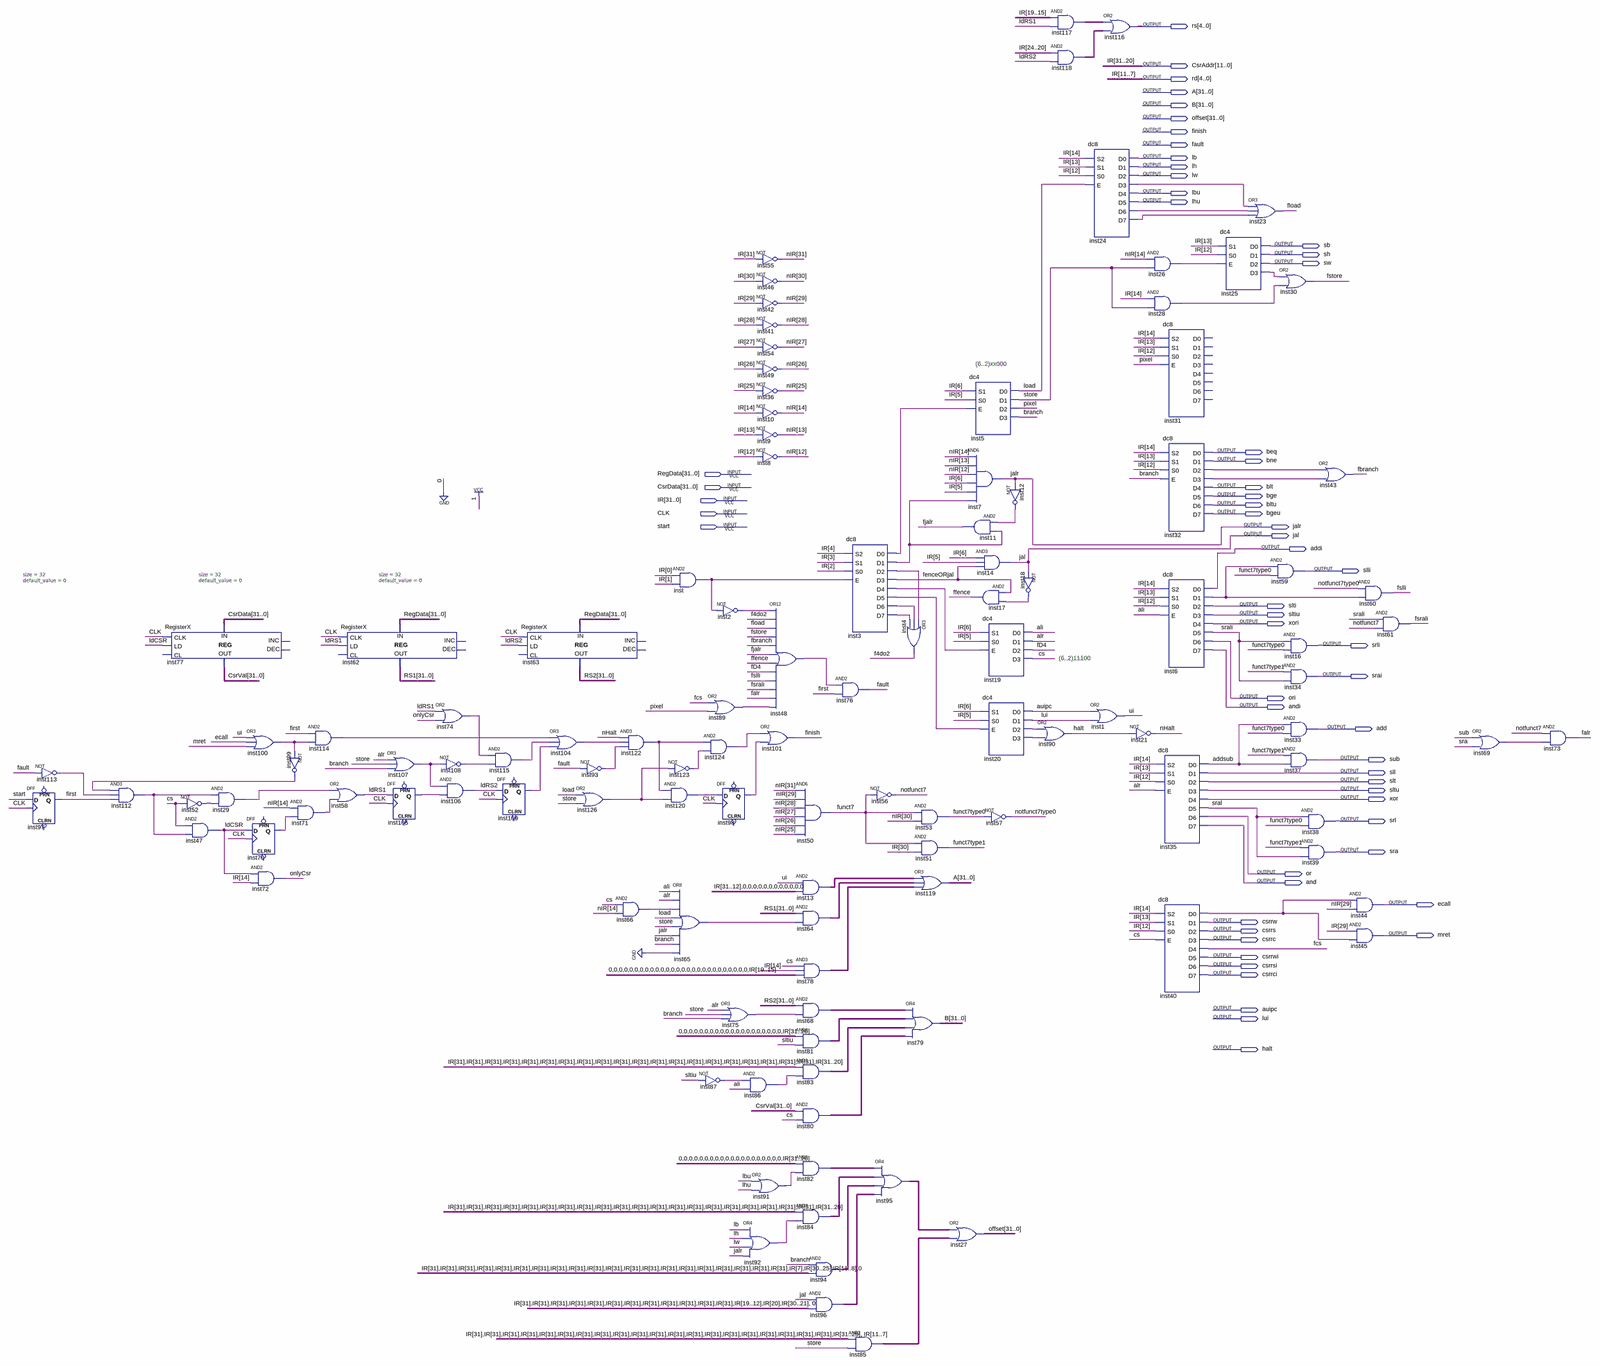
[diagram p0: schematic sheet, whole]
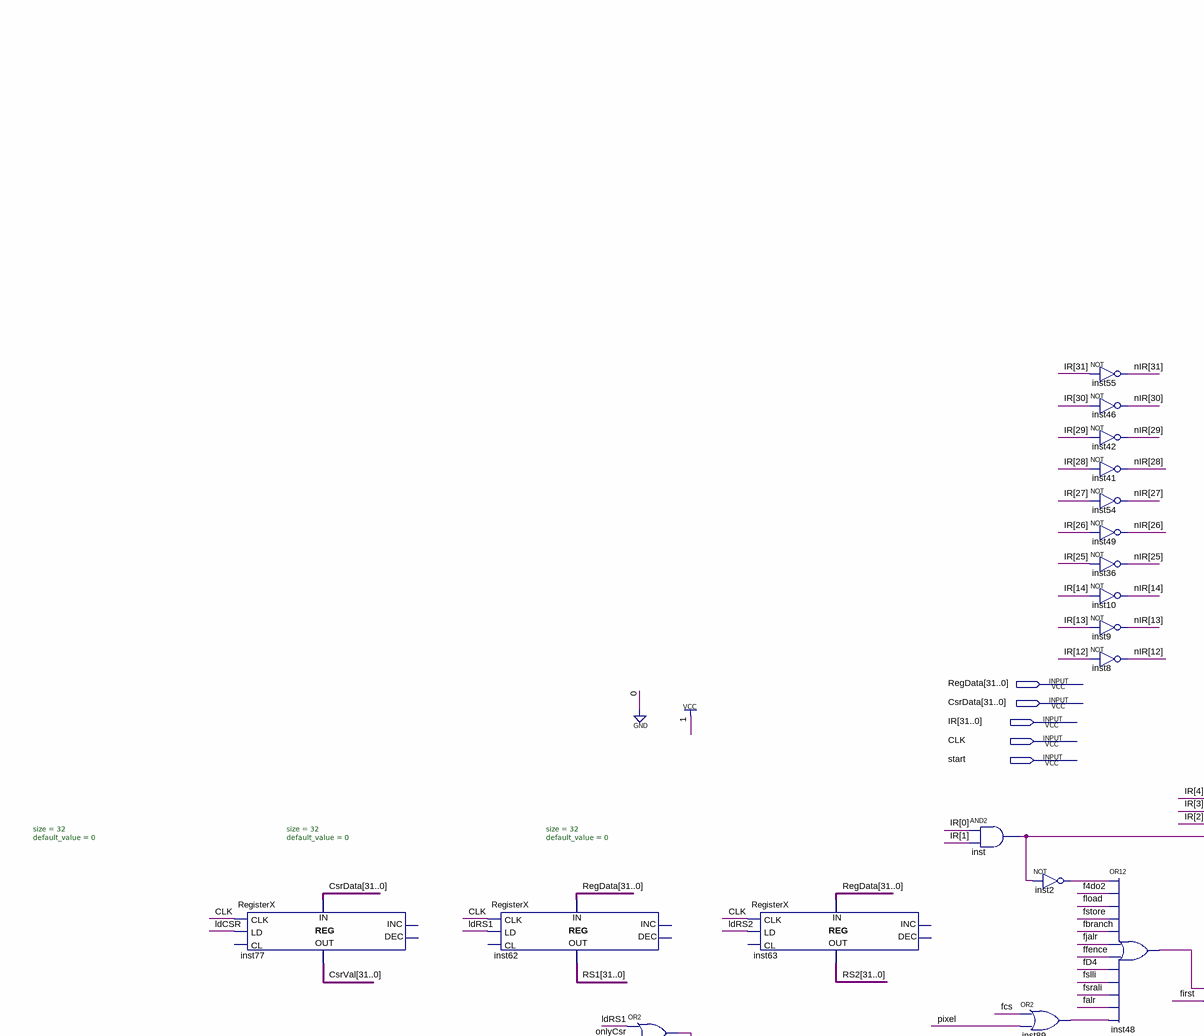
[diagram p1: schematic sheet, upper left part]
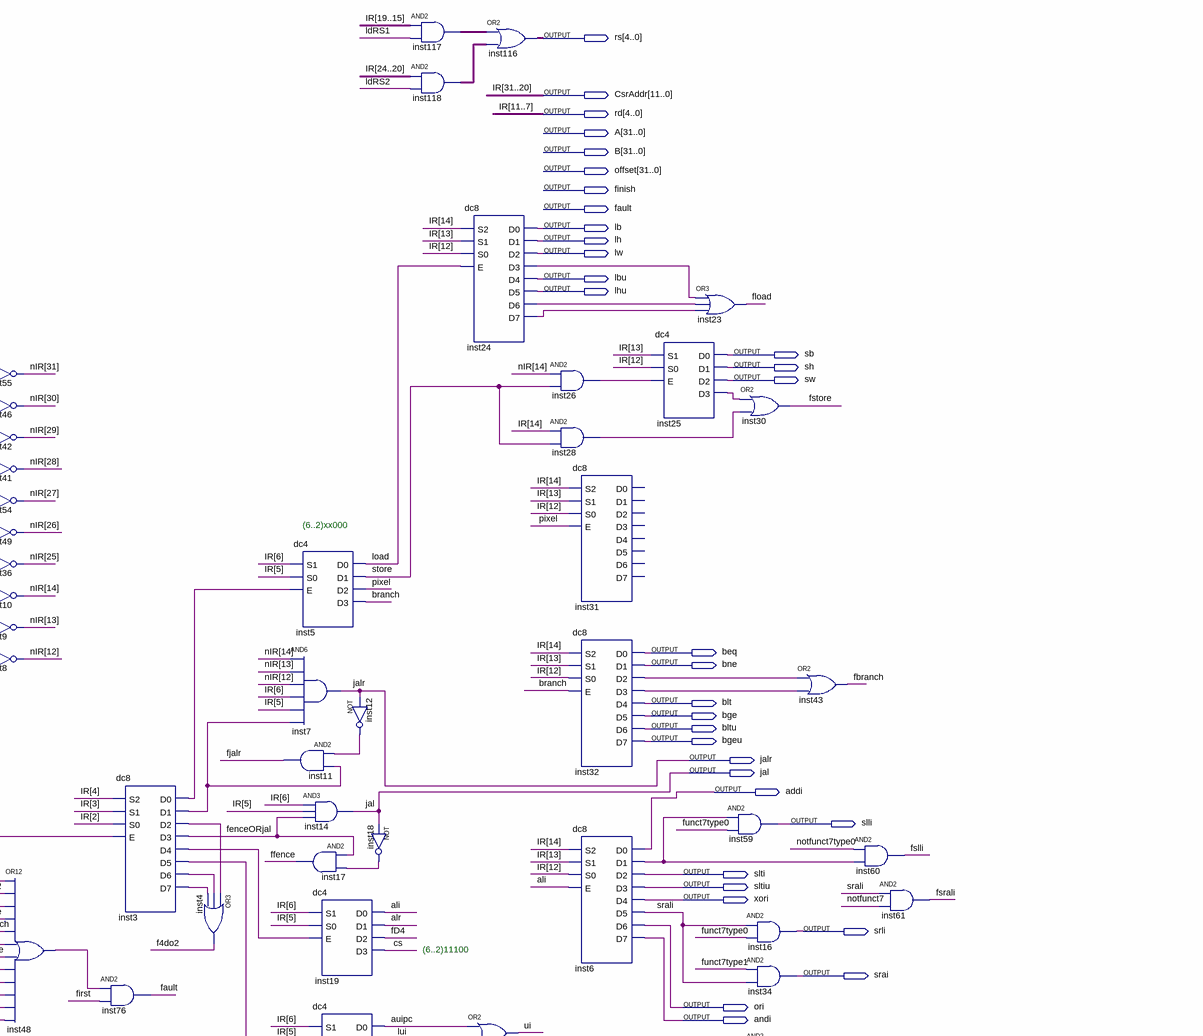
[diagram p2: schematic sheet, upper right part]
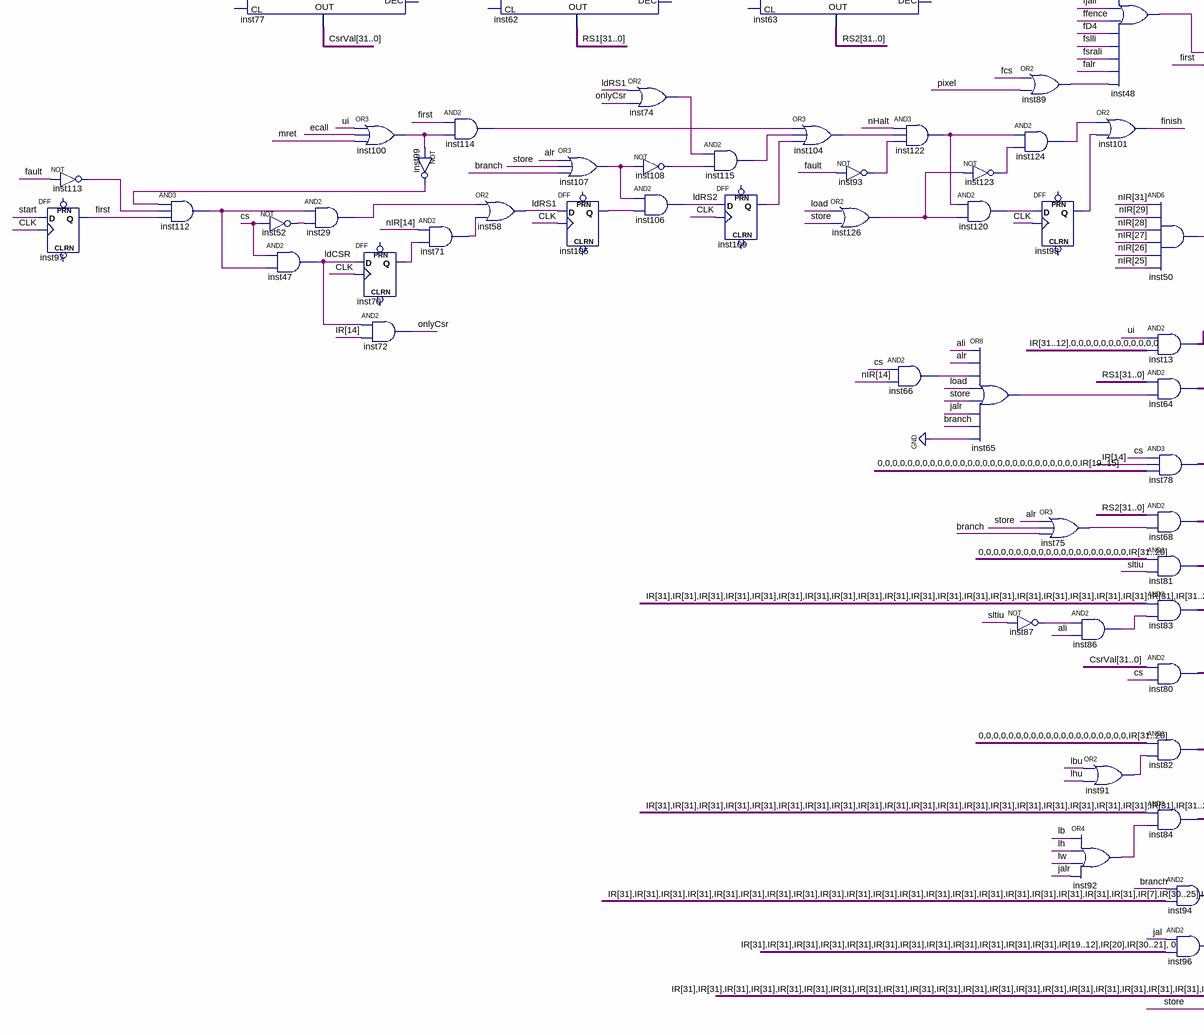
[diagram p3: schematic sheet, lower left part]
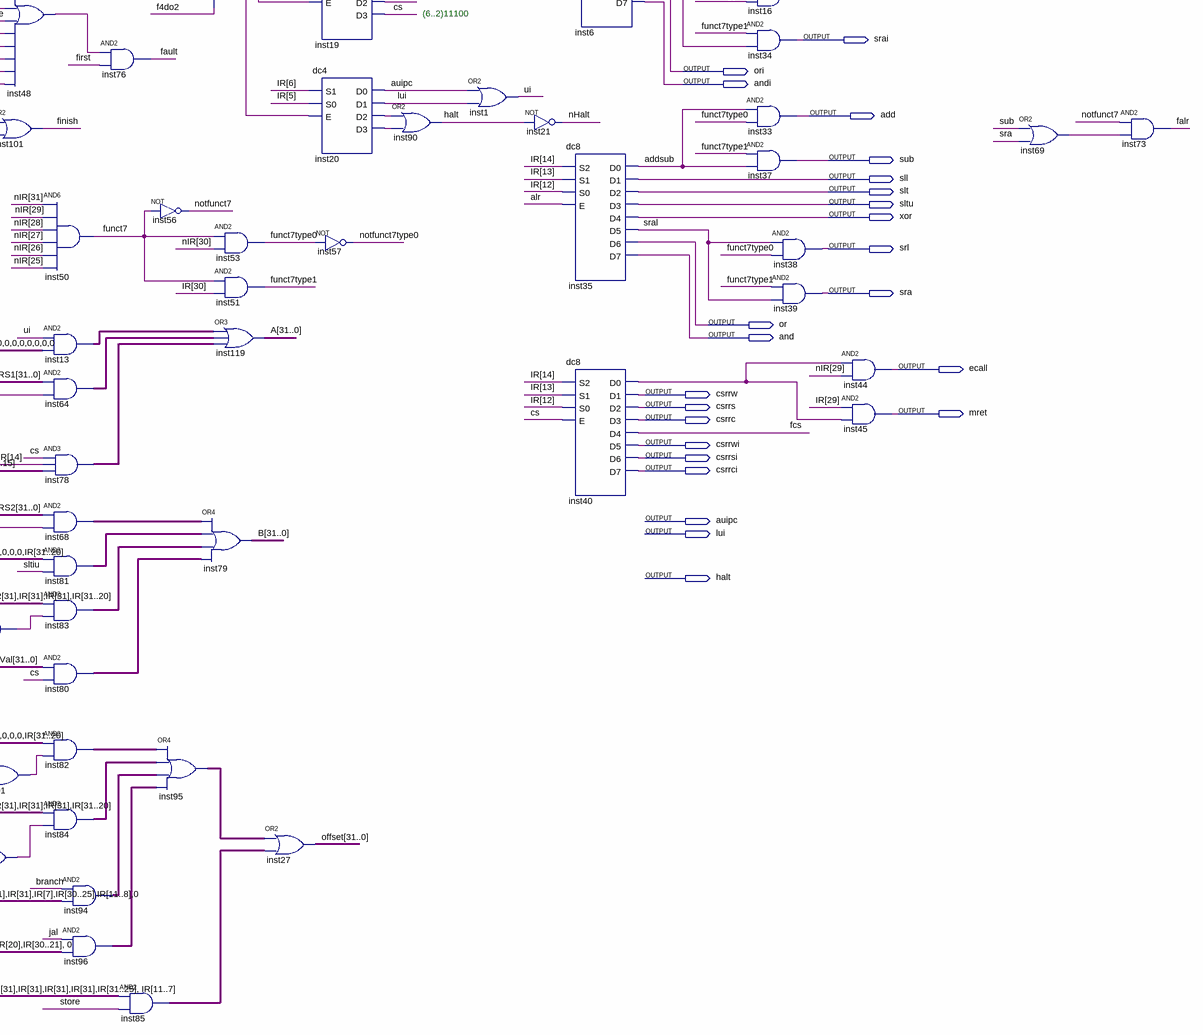
[diagram p4: schematic sheet, lower right part]
// Quartus schematic DecodeFaza.bdf as structural Verilog: 117 symbols, 59 pins
module DecodeFaza (
  input  [31:0] RegData,
  input  [31:0] CsrData,
  input  [31:0] IR,
  input  CLK,
  input  start,
  output [4:0] rs,
  output [11:0] CsrAddr,
  output [4:0] rd,
  output [31:0] A,
  output [31:0] B,
  output [31:0] offset,
  output finish,
  output fault,
  output lb,
  output lh,
  output lw,
  output lbu,
  output lhu,
  output sb,
  output sh,
  output sw,
  output beq,
  output bne,
  output blt,
  output bge,
  output bltu,
  output bgeu,
  output jalr,
  output jal,
  output addi,
  output slli,
  output slti,
  output sltiu,
  output xori,
  output srli,
  output srai,
  output ori,
  output andi,
  output add,
  output sub,
  output sll,
  output slt,
  output sltu,
  output \xor ,
  output srl,
  output sra,
  output \or ,
  output \and ,
  output ecall,
  output csrrw,
  output csrrs,
  output mret,
  output csrrc,
  output csrrwi,
  output csrrsi,
  output csrrci,
  output auipc,
  output lui,
  output halt
);

  wire addsub, ali, alr, branch, cs, f4do2, falr, fbranch, fcs, fD4, fenceORjal, ffence, first, fjalr, fload,
       fslli, fsrali, fstore, funct7, funct7type0, funct7type1, inst2_out, inst3_d0, inst3_d1, inst3_d2,
       inst3_d4, inst3_d5, inst3_d6, inst3_d7, inst6_d1, inst12_out, inst18_out, inst20_d2, inst20_d3,
       inst24_d3, inst24_d6, inst24_d7, inst25_d3, inst26_out, inst28_out, inst29_out, inst32_d2, inst32_d3,
       inst40_d0, inst48_out, inst52_out, inst65_out, inst66_out, inst69_out, inst70_q, inst71_out,
       inst74_out, inst75_out, inst86_out, inst87_out, inst89_out, inst91_out, inst92_out, inst93_out,
       inst98_q, inst99_out, inst100_out, inst104_out, inst105_q, inst107_out, inst108_out, inst109_q,
       inst112_out, inst113_out, inst114_out, inst115_out, inst120_out, inst122_out, inst123_out,
       inst124_out, inst126_out, inst_out, ldCSR, ldRS1, ldRS2, load, nHalt, notfunct7, notfunct7type0,
       onlyCsr, pixel, sral, srali, store, ui;
  wire [4:0] inst117_out, inst118_out;
  wire [31:0] CsrVal, inst13_out, inst64_out, inst68_out, inst78_out, inst80_out, inst81_out, inst82_out,
       inst83_out, inst84_out, inst85_out, inst94_out, inst95_out, inst96_out, RS1, RS2;
  wire [31:12] nIR;

  not inst113 (inst113_out, fault);
  DFF inst97 (.CLK(CLK), .D(start), .Q(first));  // open: CLRN, PRN
  and inst112 (inst112_out, inst99_out, inst113_out, first);
  RegisterX #(.size(32), .default_value(0)) inst77 (
    .CLK(CLK), .LD(ldCSR), .DATA_IN(CsrData), .DATA_OUT(CsrVal));  // open: CL, INC, DEC
  not inst52 (inst52_out, cs);
  and inst47 (ldCSR, cs, inst112_out);
  and inst29 (inst29_out, inst112_out, inst52_out);
  or inst100 (inst100_out, ui, ecall, mret);
  DFF inst70 (.CLK(CLK), .D(ldCSR), .Q(inst70_q));  // open: CLRN, PRN
  and inst72 (onlyCsr, ldCSR, IR[14]);
  not inst99 (inst99_out, inst100_out);
  and inst71 (inst71_out, nIR[14], inst70_q);
  and inst114 (inst114_out, first, inst100_out);
  or inst58 (ldRS1, inst29_out, inst71_out);
  RegisterX #(.size(32), .default_value(0)) inst62 (
    .CLK(CLK), .LD(ldRS1), .DATA_IN(RegData), .DATA_OUT(RS1));  // open: CL, INC, DEC
  or inst107 (inst107_out, alr, store, branch);
  DFF inst105 (.CLK(CLK), .D(ldRS1), .Q(inst105_q));  // open: CLRN, PRN
  or inst74 (inst74_out, ldRS1, onlyCsr);
  not inst108 (inst108_out, inst107_out);
  and inst106 (ldRS2, inst107_out, inst105_q);
  and inst115 (inst115_out, inst74_out, inst108_out);
  DFF inst109 (.CLK(CLK), .D(ldRS2), .Q(inst109_q));  // open: CLRN, PRN
  RegisterX #(.size(32), .default_value(0)) inst63 (
    .CLK(CLK), .LD(ldRS2), .DATA_IN(RegData), .DATA_OUT(RS2));  // open: CL, INC, DEC
  or inst104 (inst104_out, inst114_out, inst115_out, inst109_q);
  not inst93 (inst93_out, fault);
  or inst126 (inst126_out, load, store);
  and inst66 (inst66_out, cs, nIR[14]);
  and inst122 (inst122_out, nHalt, inst104_out, inst93_out);
  and inst (inst_out, IR[0], IR[1]);
  not inst123 (inst123_out, inst126_out);
  and inst120 (inst120_out, inst122_out, inst126_out);
  or inst65 (inst65_out, ali, alr, inst66_out, load, store, jalr, branch, 1'b0);
  not inst2 (inst2_out, inst_out);
  or inst89 (inst89_out, fcs, pixel);
  and inst124 (inst124_out, inst122_out, inst123_out);
  DFF inst98 (.CLK(CLK), .D(inst120_out), .Q(inst98_q));  // open: CLRN, PRN
  or inst75 (inst75_out, alr, store, branch);
  not inst87 (inst87_out, sltiu);
  not inst55 (nIR[31], IR[31]);
  not inst46 (nIR[30], IR[30]);
  not inst42 (nIR[29], IR[29]);
  not inst41 (nIR[28], IR[28]);
  not inst54 (nIR[27], IR[27]);
  not inst49 (nIR[26], IR[26]);
  not inst36 (nIR[25], IR[25]);
  not inst10 (nIR[14], IR[14]);
  not inst9 (nIR[13], IR[13]);
  not inst8 (nIR[12], IR[12]);
  and inst86 (inst86_out, inst87_out, ali);
  or inst91 (inst91_out, lbu, lhu);
  or inst92 (inst92_out, lb, lh, lw, jalr);
  or inst48 (inst48_out, inst2_out, f4do2, fload, fstore, fbranch, fjalr, ffence, fD4, fslli, fsrali, falr, inst89_out);
  or inst101 (finish, inst124_out, inst98_q);
  and inst50 (funct7, nIR[31], nIR[29], nIR[28], nIR[27], nIR[26], nIR[25]);
  assign inst13_out = {32{ui}} & {IR[31:12], {12{1'b0}}};  // AND2 inst13, 32 bits wide
  assign inst64_out = RS1 & {32{inst65_out}};  // AND2 inst64, 32 bits wide
  assign inst78_out = {32{cs}} & {32{IR[14]}} & {{27{1'b0}}, IR[19:15]};  // AND3 inst78, 32 bits wide
  assign inst68_out = RS2 & {32{inst75_out}};  // AND2 inst68, 32 bits wide
  assign inst81_out = {{20{1'b0}}, IR[31:20]} & {32{sltiu}};  // AND2 inst81, 32 bits wide
  assign inst83_out = {{21{IR[31]}}, IR[30:20]} & {32{inst86_out}};  // AND2 inst83, 32 bits wide
  assign inst80_out = CsrVal & {32{cs}};  // AND2 inst80, 32 bits wide
  assign inst82_out = {{20{1'b0}}, IR[31:20]} & {32{inst91_out}};  // AND2 inst82, 32 bits wide
  assign inst84_out = {{21{IR[31]}}, IR[30:20]} & {32{inst92_out}};  // AND2 inst84, 32 bits wide
  assign inst94_out = {32{branch}} & {{20{IR[31]}}, IR[7], IR[30:25], IR[11:8], 1'b0};  // AND2 inst94, 32 bits wide
  assign inst96_out = {32{jal}} & {{12{IR[31]}}, IR[19:12], IR[20], IR[30:21], 1'b0};  // AND2 inst96, 32 bits wide
  dc8 inst3 (
    .S2(IR[4]), .S1(IR[3]), .S0(IR[2]), .E(inst_out), .D0(inst3_d0), .D1(inst3_d1), .D2(inst3_d2),
    .D3(fenceORjal), .D4(inst3_d4), .D5(inst3_d5), .D6(inst3_d6), .D7(inst3_d7));
  and inst76 (fault, inst48_out, first);
  assign inst85_out = {{21{IR[31]}}, IR[30:25], IR[11:7]} & {32{store}};  // AND2 inst85, 32 bits wide
  not inst56 (notfunct7, funct7);
  assign inst95_out = inst82_out | inst84_out | inst94_out | inst96_out;  // OR4 inst95, 32 bits wide
  or inst4 (f4do2, inst3_d2, inst3_d6, inst3_d7);
  and inst53 (funct7type0, funct7, nIR[30]);
  and inst51 (funct7type1, funct7, IR[30]);
  assign A = inst13_out | inst64_out | inst78_out;  // OR3 inst119, 32 bits wide
  assign B = inst68_out | inst81_out | inst83_out | inst80_out;  // OR4 inst79, 32 bits wide
  dc4 inst5 (.S1(IR[6]), .S0(IR[5]), .E(inst3_d0), .D0(load), .D1(store), .D2(pixel), .D3(branch));
  and inst7 (jalr, nIR[14], nIR[13], nIR[12], IR[6], IR[5], inst3_d1);
  and inst11 (fjalr, inst12_out, inst3_d1);
  assign offset = inst95_out | inst85_out;  // OR2 inst27, 32 bits wide
  and inst14 (jal, IR[6], IR[5], fenceORjal);
  and inst17 (ffence, fenceORjal, inst18_out);
  dc4 inst19 (.S1(IR[6]), .S0(IR[5]), .E(inst3_d4), .D0(ali), .D1(alr), .D2(fD4), .D3(cs));
  dc4 inst20 (.S1(IR[6]), .S0(IR[5]), .E(inst3_d5), .D0(auipc), .D1(lui), .D2(inst20_d2), .D3(inst20_d3));
  not inst57 (notfunct7type0, funct7type0);
  not inst12 (inst12_out, jalr);
  not inst18 (inst18_out, jal);
  or inst90 (halt, inst20_d2, inst20_d3);
  assign inst117_out = IR[19:15] & {5{ldRS1}};  // AND2 inst117, 5 bits wide
  assign inst118_out = IR[24:20] & {5{ldRS2}};  // AND2 inst118, 5 bits wide
  assign rs = inst117_out | inst118_out;  // OR2 inst116, 5 bits wide
  dc8 inst24 (
    .S2(IR[14]), .S1(IR[13]), .S0(IR[12]), .E(load), .D0(lb), .D1(lh), .D2(lw), .D3(inst24_d3), .D4(lbu),
    .D5(lhu), .D6(inst24_d6), .D7(inst24_d7));
  or inst1 (ui, auipc, lui);
  not inst21 (nHalt, halt);
  and inst26 (inst26_out, nIR[14], store);
  and inst28 (inst28_out, IR[14], store);
  dc8 inst31 (.S2(IR[14]), .S1(IR[13]), .S0(IR[12]), .E(pixel));  // open: D0, D1, D2, D3, D4, D5, D6, D7
  dc8 inst32 (
    .S2(IR[14]), .S1(IR[13]), .S0(IR[12]), .E(branch), .D0(beq), .D1(bne), .D2(inst32_d2), .D3(inst32_d3),
    .D4(blt), .D5(bge), .D6(bltu), .D7(bgeu));
  dc8 inst6 (
    .S2(IR[14]), .S1(IR[13]), .S0(IR[12]), .E(ali), .D0(addi), .D1(inst6_d1), .D2(slti), .D3(sltiu),
    .D4(xori), .D5(srali), .D6(ori), .D7(andi));
  dc8 inst35 (
    .S2(IR[14]), .S1(IR[13]), .S0(IR[12]), .E(alr), .D0(addsub), .D1(sll), .D2(slt), .D3(sltu), .D4(\xor ),
    .D5(sral), .D6(\or ), .D7(\and ));
  dc8 inst40 (
    .S2(IR[14]), .S1(IR[13]), .S0(IR[12]), .E(cs), .D0(inst40_d0), .D1(csrrw), .D2(csrrs), .D3(csrrc),
    .D4(fcs), .D5(csrrwi), .D6(csrrsi), .D7(csrrci));
  or inst23 (fload, inst24_d3, inst24_d6, inst24_d7);
  dc4 inst25 (.S1(IR[13]), .S0(IR[12]), .E(inst26_out), .D0(sb), .D1(sh), .D2(sw), .D3(inst25_d3));
  or inst30 (fstore, inst25_d3, inst28_out);
  and inst59 (slli, inst6_d1, funct7type0);
  and inst16 (srli, srali, funct7type0);
  and inst34 (srai, funct7type1, srali);
  and inst33 (add, addsub, funct7type0);
  and inst37 (sub, funct7type1, addsub);
  or inst43 (fbranch, inst32_d2, inst32_d3);
  and inst38 (srl, sral, funct7type0);
  and inst39 (sra, funct7type1, sral);
  and inst44 (ecall, inst40_d0, nIR[29]);
  and inst45 (mret, IR[29], inst40_d0);
  and inst60 (fslli, notfunct7type0, inst6_d1);
  and inst61 (fsrali, srali, notfunct7);
  or inst69 (inst69_out, sub, sra);
  and inst73 (falr, notfunct7, inst69_out);

  assign CsrAddr = IR[31:20];
  assign rd = IR[11:7];

  // Notes on the sheet:
  //   (6..2)xx000
  //   (6..2)11100
endmodule
